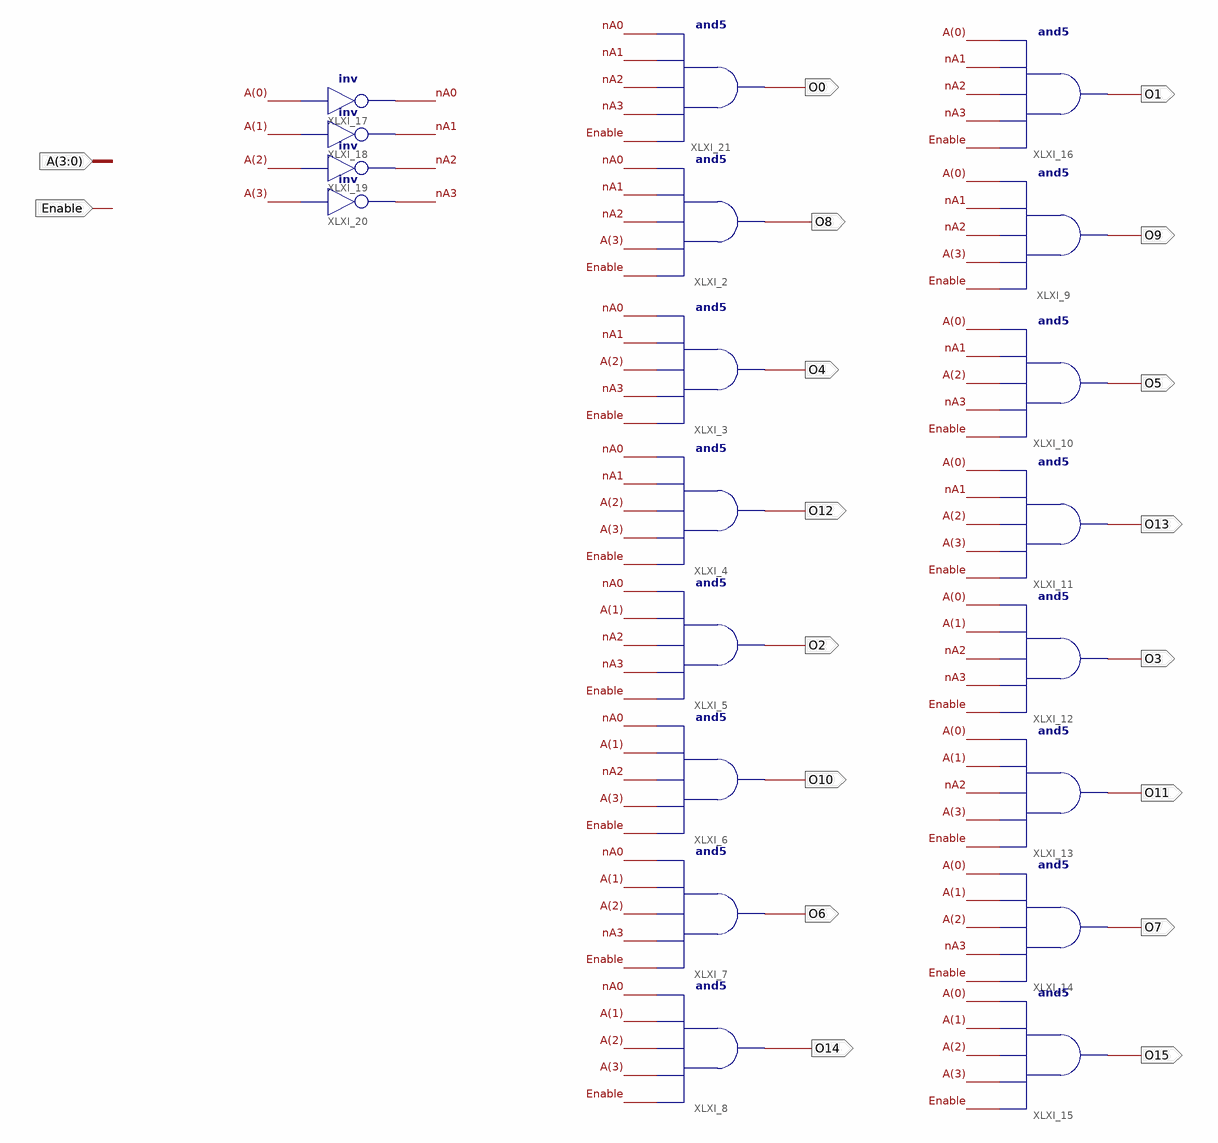
[diagram p0: schematic sheet 1]
// Xilinx ISE schematic decode4b16.sch (spartan3e) as structural Verilog: 20 symbols, 18 ports
module decode4b16 (
  input  [3:0] A,
  input  Enable,
  output O0,
  output O1,
  output O2,
  output O3,
  output O5,
  output O6,
  output O15,
  output O14,
  output O11,
  output O9,
  output O8,
  output O4,
  output O12,
  output O10,
  output O7,
  output O13
);

  wire nA0, nA1, nA2, nA3;

  and XLXI_2 (O8, Enable, A[3], nA2, nA1, nA0);
  and XLXI_3 (O4, Enable, nA3, A[2], nA1, nA0);
  and XLXI_4 (O12, Enable, A[3], A[2], nA1, nA0);
  and XLXI_5 (O2, Enable, nA3, nA2, A[1], nA0);
  and XLXI_6 (O10, Enable, A[3], nA2, A[1], nA0);
  and XLXI_7 (O6, Enable, nA3, A[2], A[1], nA0);
  and XLXI_8 (O14, Enable, A[3], A[2], A[1], nA0);
  and XLXI_9 (O9, Enable, A[3], nA2, nA1, A[0]);
  and XLXI_10 (O5, Enable, nA3, A[2], nA1, A[0]);
  and XLXI_11 (O13, Enable, A[3], A[2], nA1, A[0]);
  and XLXI_12 (O3, Enable, nA3, nA2, A[1], A[0]);
  and XLXI_13 (O11, Enable, A[3], nA2, A[1], A[0]);
  and XLXI_14 (O7, Enable, nA3, A[2], A[1], A[0]);
  and XLXI_15 (O15, Enable, A[3], A[2], A[1], A[0]);
  and XLXI_16 (O1, Enable, nA3, nA2, nA1, A[0]);
  not XLXI_17 (nA0, A[0]);
  not XLXI_18 (nA1, A[1]);
  not XLXI_19 (nA2, A[2]);
  not XLXI_20 (nA3, A[3]);
  and XLXI_21 (O0, Enable, nA3, nA2, nA1, nA0);
endmodule
